# EasyEDA Pro project sensor-coils-example-4.epro

# Board 2024-06-03_06-23-40
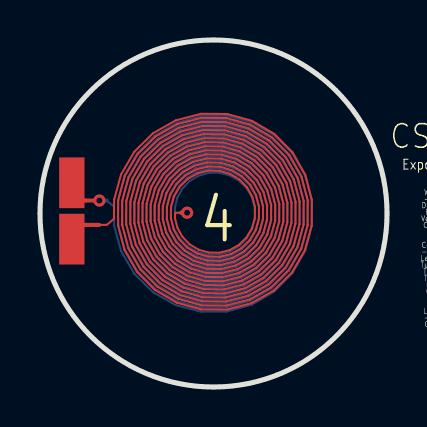
[diagram p0: board, top side]
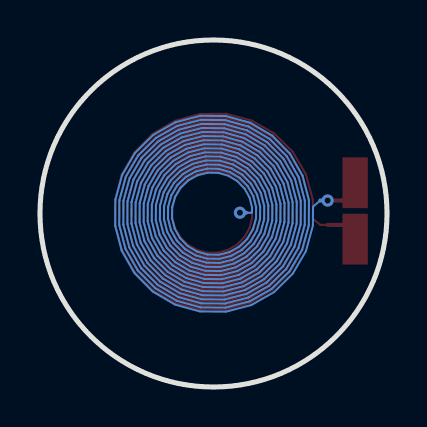
[diagram p1: board, bottom side, seen from below]

Outline 17.36 x 17.36 mm; copper layers: Top Layer, Bottom Layer. Coordinates in mm from the lower left corner of the outline.
Outline path: circle c8.68,8.68 r8.68
Stack: Top Layer 0.035mm - / Dielectric1 1.51mm FR4 er 4.5 / Bottom Layer 0.035mm -

## Design rules (mm)
template: 用户自定义配置
spacing safeClearance (default): track to track 0.152, other pairs 0.152 to 0.3
track width trackWidth (default): min 0.025, default 0.254, max 2.54
differential pair differentialPair (default): width min 0.127, default 0.254, max 2.54; gap min 0.152, default 0.152
via viaSize (default): diameter min 0.5, default 0.61, max 10; hole min 0.3, default 0.305, max 5.999

## Placement (name value [footprint] x y rotation side)
CSENSOR  -  [0805]  1.59 8.81 90 top

## Footprints (pads in the part's own frame, mm; a bottom-side part is the same pattern mirrored in y, then rotated)
0805
  rect 2.54x1.27 smd: 1(-1.409,0) 2(1.409,0)

## Nets
3: CSENSOR.1 CSENSOR.2

## Via types
v1: diameter 0.61, hole 0.305, Top Layer to Bottom Layer, 2 vias

## Routing (per net, layer and track width the routed paths; a pad name or vN(x,y) marks a point on that pad's centre or on a via; arc(x,y) is an arc through that point)
3: length 664.4
  Top Layer w0.102: 7.06,8.72 6.76,8.72 6.75,8.46 6.88,7.96 7.13,7.51 7.49,7.14 7.94,6.87 8.44,6.73 8.97,6.72 9.48,6.85 9.94,7.1 10.32,7.47 10.6,7.93 10.75,8.45 10.75,8.99 10.62,9.52 10.36,9.99 9.98,10.38 9.51,10.66 8.98,10.82 8.42,10.82 7.89,10.69 7.4,10.42 7,10.03 6.71,9.54 6.56,9 6.55,8.44 6.69,7.88 6.96,7.39 7.36,6.98 7.86,6.68 8.41,6.52 8.99,6.51 9.56,6.66 10.07,6.94 10.49,7.35 10.79,7.86 10.95,8.42 10.96,9.02 10.81,9.59 10.52,10.12 10.1,10.55 9.59,10.85 9,11.02 8.4,11.03 7.81,10.88 7.27,10.58 6.84,10.15 6.52,9.62 6.35,9.03 6.34,8.41 6.5,7.81 6.8,7.26 7.24,6.81 7.78,6.49 8.39,6.32 9.02,6.31 9.63,6.47 10.19,6.78 10.65,7.23 10.98,7.78 11.15,8.4 11.16,9.04 11,9.67 10.68,10.24 10.23,10.71 9.66,11.04 9.03,11.22 8.37,11.23 7.73,11.07 7.15,10.74 6.67,10.28 6.33,9.7 6.15,9.06 6.14,8.38 6.31,7.73 6.64,7.14 7.11,6.65 7.7,6.3 8.36,6.12 9.05,6.11 9.71,6.28 10.32,6.62 10.81,7.1 11.17,7.7 11.36,8.37 11.36,9.07 11.19,9.75 10.85,10.37 10.35,10.87 9.74,11.23 9.06,11.42 8.34,11.43 7.65,11.26 7.03,10.9 6.51,10.4 6.14,9.78 5.95,9.08 5.94,8.36 6.12,7.65 6.48,7.01 6.99,6.49 7.62,6.11 8.33,5.91 9.07,5.9 9.79,6.09 10.44,6.45 10.97,6.98 11.36,7.62 11.56,8.34 11.57,9.1 11.38,9.83 11.01,10.49 10.48,11.03 9.82,11.42 9.08,11.63 8.32,11.64 7.57,11.45 6.9,11.07 6.35,10.53 5.95,9.86 5.74,9.11 5.73,8.33 5.93,7.57 6.31,6.89 6.86,6.32 7.54,5.92 8.31,5.71 9.1,5.7 9.87,5.9 10.57,6.29 11.14,6.85 11.55,7.54 11.76,8.32 11.77,9.12 11.57,9.91 11.17,10.61 10.6,11.2 9.9,11.61 9.11,11.83 8.29,11.84 7.49,11.63 6.78,11.23 6.18,10.65 5.76,9.94 5.54,9.14 5.53,8.3 5.74,7.49 6.15,6.76 6.74,6.16 7.46,5.73 8.28,5.51 9.13,5.5 9.95,5.71 10.69,6.13 11.3,6.73 11.74,7.46 11.97,8.29 11.97,9.15 11.76,9.99 11.33,10.74 10.73,11.36 9.98,11.8 9.14,12.03 8.26,12.04 7.42,11.82 6.65,11.39 6.02,10.78 5.57,10.02 5.34,9.16 5.33,8.28 5.55,7.41 5.99,6.64 6.61,6 7.39,5.54 8.25,5.3 9.15,5.29 10.03,5.52 10.81,5.97 11.46,6.6 11.92,7.38 12.17,8.26 12.18,9.18 11.95,10.06 11.5,10.86 10.85,11.52 10.06,11.99 9.16,12.24 8.24,12.25 7.34,12.01 6.53,11.56 5.86,10.9 5.38,10.09 5.13,9.19 5.12,8.25 5.36,7.34 5.83,6.51 6.49,5.84 7.31,5.35 8.23,5.1 9.18,5.09 10.11,5.33 10.94,5.8 11.63,6.48 12.11,7.31 12.37,8.24 12.38,9.2 12.14,10.14 11.66,10.99 10.98,11.68 10.13,12.18 9.19,12.44 8.21,12.45 7.26,12.2 6.4,11.72 5.7,11.03 5.19,10.17 4.93,9.22 4.92,8.22 5.17,7.26 5.66,6.39 6.36,5.67 7.23,5.17 8.2,4.9 9.21,4.89 10.18,5.14 11.06,5.64 11.79,6.35 12.3,7.23 12.58,8.21 12.58,9.23 12.33,10.22 11.82,11.11 11.1,11.85 10.21,12.37 9.22,12.64 8.18,12.65 7.18,12.39 6.28,11.88 5.53,11.15 5.01,10.25 4.73,9.24 4.72,8.2 4.98,7.18 5.5,6.26 6.24,5.51 7.15,4.98 8.17,4.69 9.23,4.69 10.26,4.95 11.19,5.48 11.95,6.23 12.49,7.15 12.78,8.18 12.79,9.26 12.52,10.3 11.98,11.24 11.23,12.01 10.29,12.56 9.25,12.85 8.16,12.86 7.1,12.58 6.15,12.04 5.37,11.27 4.82,10.33 4.52,9.27 4.51,8.17 4.79,7.1 5.34,6.14 6.12,5.35 7.07,4.79 8.14,4.49 9.26,4.48 10.34,4.76 11.31,5.32 12.11,6.1 12.68,7.07 12.98,8.16 12.99,9.28 12.71,10.38 12.15,11.36 11.35,12.17 10.37,12.75 9.27,13.05 8.13,13.06 7.02,12.77 6.03,12.21 5.21,11.4 4.63,10.41 4.32,9.3 4.31,8.14 4.6,7.02 5.18,6.01 5.99,5.19 6.99,4.6 8.12,4.29 9.29,4.28 10.42,4.57 11.44,5.15 12.28,5.98 12.87,6.99 13.18,8.13 13.19,9.31 12.9,10.46 12.31,11.49 11.48,12.33 10.45,12.94 9.3,13.25 8.1,13.26 6.95,12.96 5.9,12.37 5.05,11.52 4.44,10.49 4.12,9.32 4.11,8.11 4.41,6.94 5.01,5.89 5.87,5.02 6.92,4.41 8.09,4.08 9.31,4.08 10.5,4.38 11.56,4.99 12.44,5.85 13.06,6.91 13.39,8.1 13.4,9.34 13.08,10.54 12.47,11.61 11.6,12.5 10.53,13.13 9.33,13.46 8.08,13.47 6.87,13.15 5.78,12.53 4.88,11.65 4.25,10.56 3.91,9.35 3.91,8.09 4.22,6.87 4.85,5.76 5.74,4.86 6.84,4.22 8.06,3.88 9.34,3.87 10.58,4.19 11.69,4.83 12.6,5.73 13.25,6.84 13.59,8.08 13.6,9.36 13.27,10.61 12.63,11.74 11.72,12.66 10.61,13.32 9.35,13.66 8.05,13.67 6.79,13.34 5.65,12.69 4.72,11.77 4.06,10.64 3.71,9.38 3.7,8.72 3.7,8.41 3.34,8.11 2.97,8.11
  Top Layer w0.203: v1(2.97,9.33) 2.29,9.33 1.6,9.42 1.6,9.51 ; 1.6,8.11 2.97,8.11 ; v1(7.36,8.72) 7.06,8.72
  Bottom Layer w0.102: 7.06,8.72 6.76,8.72 6.75,8.98 6.88,9.48 7.13,9.93 7.49,10.3 7.94,10.57 8.44,10.71 8.97,10.72 9.48,10.59 9.94,10.34 10.32,9.96 10.6,9.51 10.75,8.99 10.75,8.45 10.62,7.92 10.36,7.45 9.98,7.06 9.51,6.77 8.98,6.62 8.42,6.62 7.89,6.75 7.4,7.02 7,7.41 6.71,7.89 6.56,8.44 6.55,9 6.69,9.55 6.96,10.05 7.36,10.46 7.86,10.76 8.41,10.92 8.99,10.93 9.56,10.78 10.07,10.5 10.49,10.09 10.79,9.58 10.95,9.02 10.96,8.42 10.81,7.85 10.52,7.32 10.1,6.89 9.59,6.59 9,6.42 8.4,6.41 7.81,6.56 7.27,6.86 6.84,7.29 6.52,7.82 6.35,8.41 6.34,9.03 6.5,9.63 6.8,10.18 7.24,10.63 7.78,10.95 8.39,11.12 9.02,11.13 9.63,10.97 10.19,10.66 10.65,10.21 10.98,9.66 11.15,9.04 11.16,8.4 11,7.77 10.68,7.2 10.23,6.73 9.66,6.4 9.03,6.22 8.37,6.21 7.73,6.37 7.15,6.7 6.67,7.16 6.33,7.74 6.15,8.38 6.14,9.06 6.31,9.71 6.64,10.3 7.11,10.79 7.7,11.14 8.36,11.32 9.05,11.33 9.71,11.16 10.32,10.82 10.81,10.34 11.17,9.74 11.36,9.07 11.36,8.37 11.19,7.69 10.85,7.07 10.35,6.57 9.74,6.21 9.06,6.01 8.34,6.01 7.65,6.18 7.03,6.53 6.51,7.04 6.14,7.66 5.95,8.36 5.94,9.08 6.12,9.79 6.48,10.43 6.99,10.95 7.62,11.33 8.33,11.53 9.07,11.53 9.79,11.35 10.44,10.99 10.97,10.46 11.36,9.82 11.56,9.1 11.57,8.34 11.38,7.61 11.01,6.95 10.48,6.41 9.82,6.02 9.08,5.81 8.32,5.8 7.57,5.99 6.9,6.37 6.35,6.91 5.95,7.58 5.74,8.33 5.73,9.11 5.93,9.87 6.31,10.55 6.86,11.11 7.54,11.52 8.31,11.73 9.1,11.74 9.87,11.54 10.57,11.15 11.14,10.59 11.55,9.9 11.76,9.12 11.77,8.32 11.57,7.53 11.17,6.82 10.6,6.24 9.9,5.83 9.11,5.61 8.29,5.6 7.49,5.8 6.78,6.21 6.18,6.79 5.76,7.5 5.54,8.3 5.53,9.14 5.74,9.95 6.15,10.68 6.74,11.28 7.46,11.71 8.28,11.93 9.13,11.94 9.95,11.73 10.69,11.31 11.3,10.71 11.74,9.98 11.97,9.15 11.97,8.29 11.76,7.45 11.33,6.7 10.73,6.08 9.98,5.64 9.14,5.41 8.26,5.4 7.42,5.62 6.65,6.05 6.02,6.66 5.57,7.42 5.34,8.28 5.33,9.16 5.55,10.03 5.99,10.8 6.61,11.44 7.39,11.9 8.25,12.14 9.15,12.14 10.03,11.92 10.81,11.47 11.46,10.84 11.92,10.05 12.17,9.18 12.18,8.26 11.95,7.37 11.5,6.58 10.85,5.92 10.06,5.45 9.16,5.2 8.24,5.19 7.34,5.43 6.53,5.88 5.86,6.54 5.38,7.35 5.13,8.25 5.12,9.19 5.36,10.1 5.83,10.93 6.49,11.6 7.31,12.08 8.23,12.34 9.18,12.35 10.11,12.11 10.94,11.64 11.63,10.96 12.11,10.13 12.37,9.2 12.38,8.24 12.14,7.3 11.66,6.45 10.98,5.76 10.13,5.26 9.19,5 8.21,4.99 7.26,5.24 6.4,5.72 5.7,6.41 5.19,7.27 4.93,8.22 4.92,9.22 5.17,10.18 5.66,11.05 6.36,11.77 7.23,12.27 8.2,12.54 9.21,12.55 10.18,12.3 11.06,11.8 11.79,11.09 12.3,10.21 12.58,9.23 12.58,8.21 12.33,7.22 11.82,6.33 11.1,5.59 10.21,5.07 9.22,4.8 8.18,4.79 7.18,5.05 6.28,5.56 5.53,6.29 5.01,7.19 4.73,8.2 4.72,9.24 4.98,10.26 5.5,11.18 6.24,11.93 7.15,12.46 8.17,12.75 9.23,12.75 10.26,12.49 11.19,11.96 11.95,11.21 12.49,10.29 12.78,9.26 12.79,8.18 12.52,7.14 11.98,6.2 11.23,5.43 10.29,4.88 9.25,4.59 8.16,4.58 7.1,4.86 6.15,5.4 5.37,6.16 4.82,7.11 4.52,8.17 4.51,9.27 4.79,10.34 5.34,11.3 6.12,12.09 7.07,12.65 8.14,12.95 9.26,12.96 10.34,12.68 11.31,12.12 12.11,11.34 12.68,10.37 12.98,9.28 12.99,8.16 12.71,7.06 12.15,6.08 11.35,5.27 10.37,4.69 9.27,4.39 8.13,4.38 7.02,4.67 6.03,5.23 5.21,6.04 4.63,7.03 4.32,8.14 4.31,9.3 4.6,10.42 5.18,11.43 5.99,12.25 6.99,12.84 8.12,13.15 9.29,13.16 10.42,12.87 11.44,12.29 12.28,11.46 12.87,10.45 13.18,9.31 13.19,8.13 12.9,6.98 12.31,5.95 11.48,5.11 10.45,4.5 9.3,4.19 8.1,4.18 6.95,4.48 5.9,5.07 5.05,5.92 4.44,6.95 4.12,8.12 4.11,9.32 4.41,10.5 5.01,11.55 5.87,12.42 6.92,13.03 8.09,13.36 9.31,13.36 10.5,13.06 11.56,12.45 12.44,11.59 13.06,10.53 13.39,9.34 13.4,8.1 13.08,6.9 12.47,5.83 11.6,4.94 10.53,4.31 9.33,3.98 8.08,3.97 6.87,4.29 5.78,4.91 4.88,5.79 4.25,6.87 3.91,8.09 3.91,9.35 4.22,10.57 4.85,11.68 5.74,12.58 6.84,13.22 8.06,13.56 9.34,13.57 10.58,13.24 11.69,12.61 12.6,11.71 13.25,10.6 13.59,9.36 13.6,8.07 13.27,6.83 12.63,5.7 11.72,4.78 10.61,4.12 9.35,3.78 8.05,3.77 6.79,4.1 5.65,4.75 4.72,5.67 4.06,6.8 3.71,8.06 3.7,8.72 3.7,9.02 3.34,9.33
  Bottom Layer w0.203: v1(7.36,8.72) 7.06,8.72 ; 3.34,9.33 v1(2.97,9.33)

## Text on the board
Top Silkscreen Layer: Layers = 2 | Turns = 15 | Version - 1.1 | -------------- | Design Id - 106 | Coil Parameters | Customized for LDC1612 | Trace Width = 4.0 mils | Layer Stack Information | Trace Spacing = 4.0 mils | ------------------------- | WEBENCH Design Information | Copper thickness = 1.0 Oz-Cu | Exported on - 2024/06/03 06:23:38 | Inner Diameter = 154 mils (Approx.) | Outer Diameter = 394 mils (Approx.) | Space between TOP and BOTTOM = 4.0 mils | Exported from WEBENCH Coil Designer Tool | 4
